# Altium schematic sheet Drone.SchDoc
size 594 x 420 mm
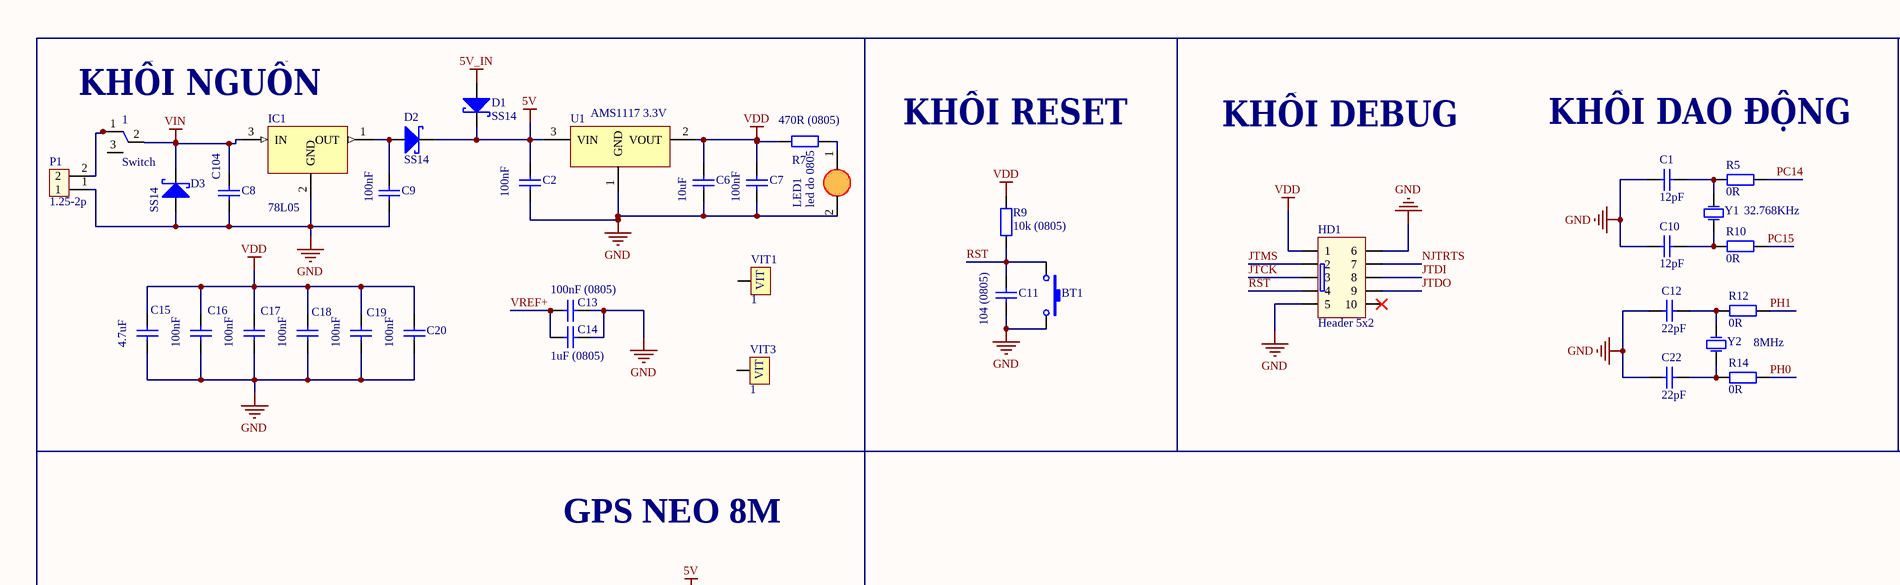
[diagram p0: Drone.SchDoc, top left]
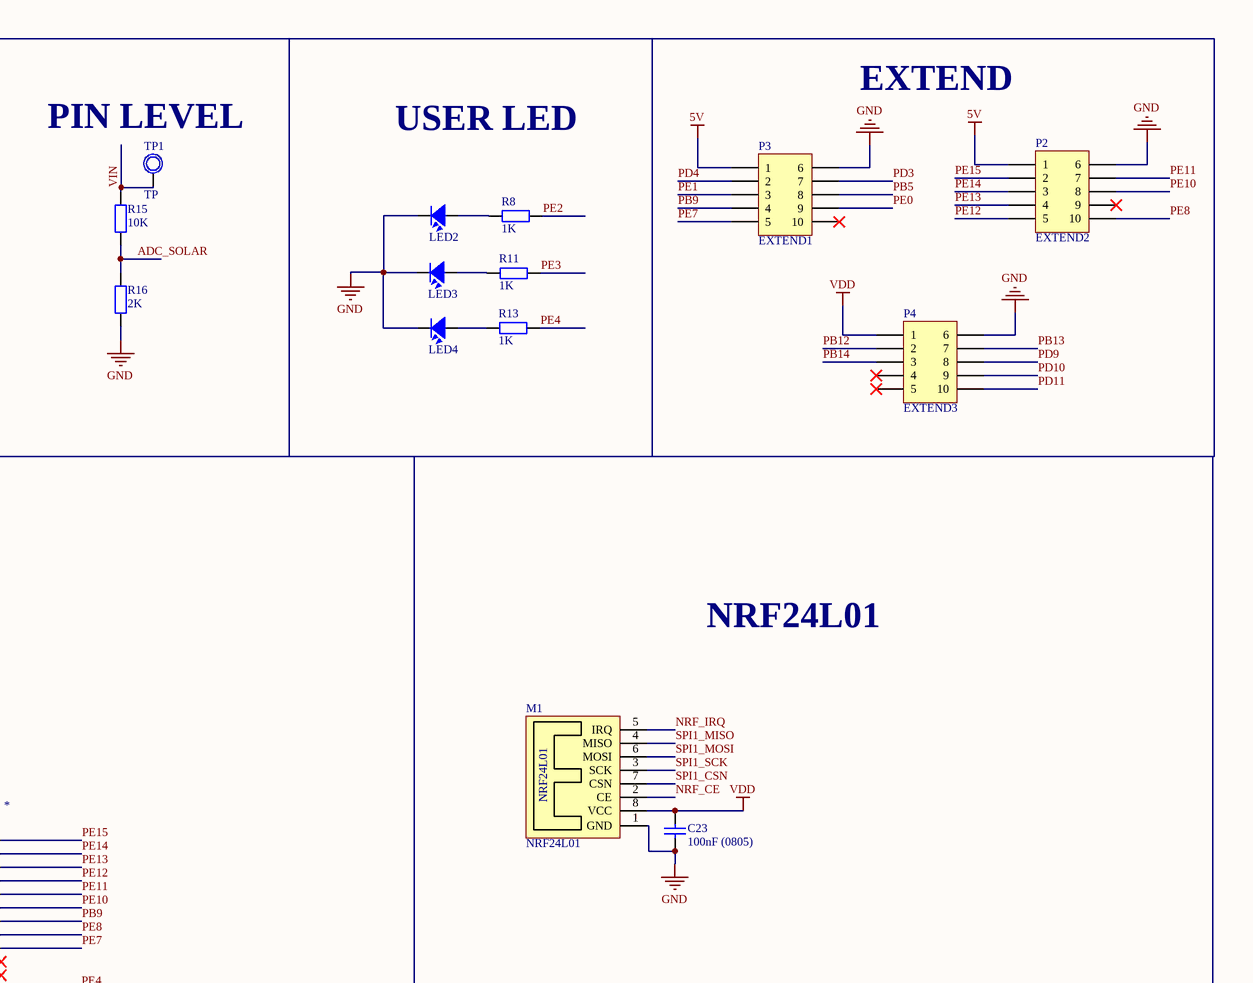
[diagram p1: Drone.SchDoc, top right]
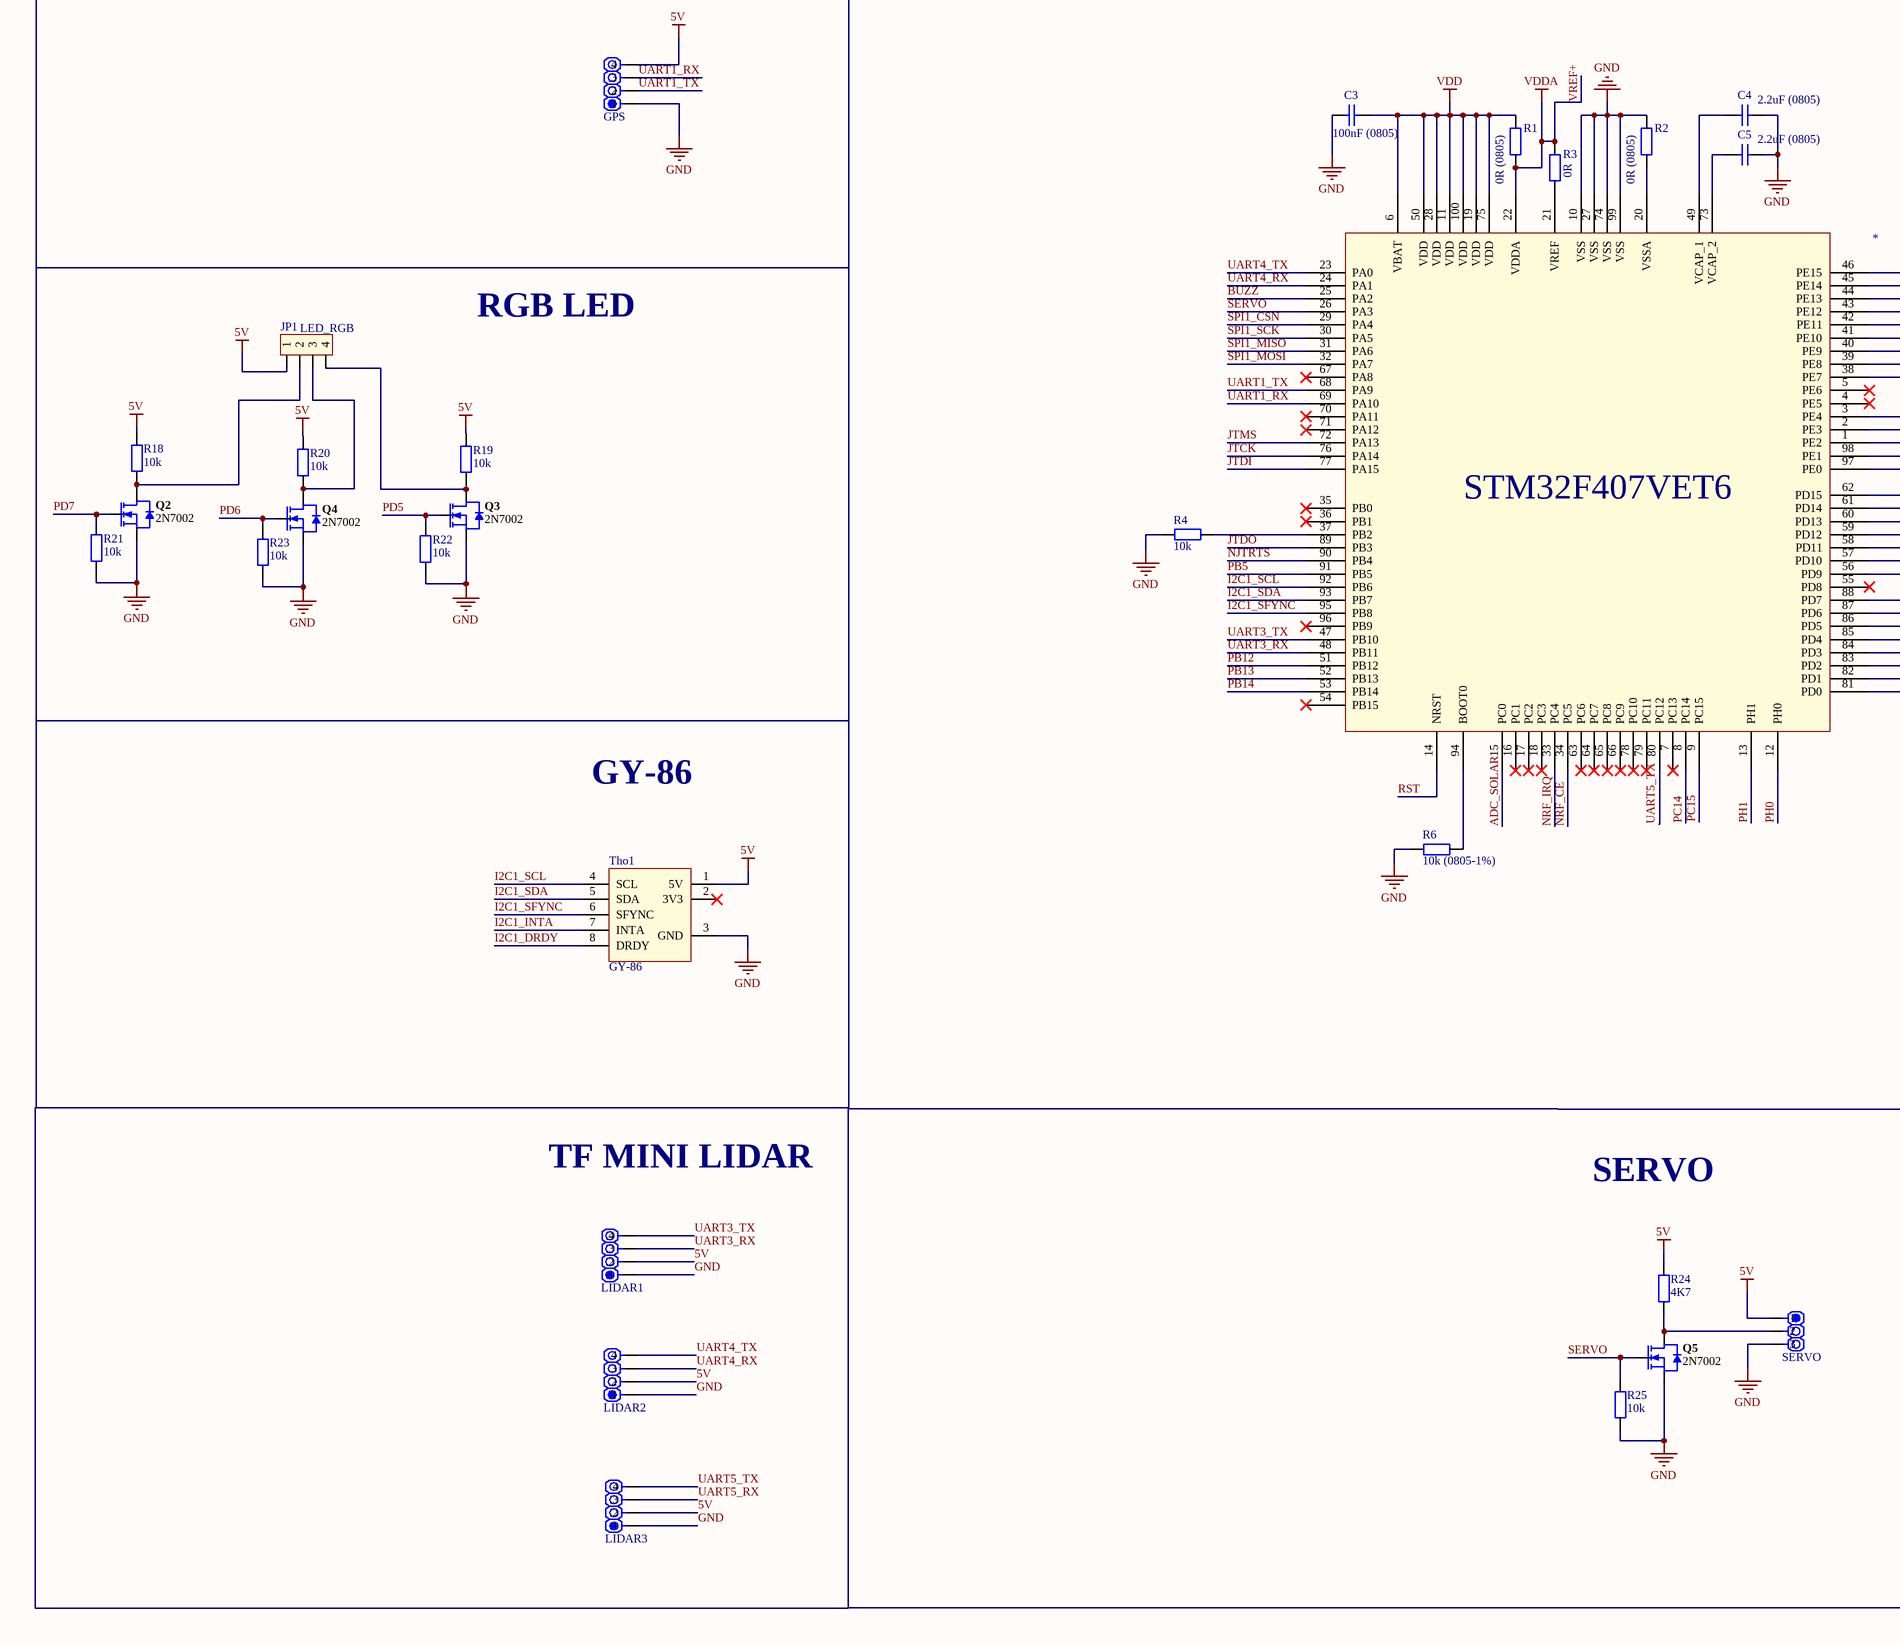
[diagram p2: Drone.SchDoc, bottom left]
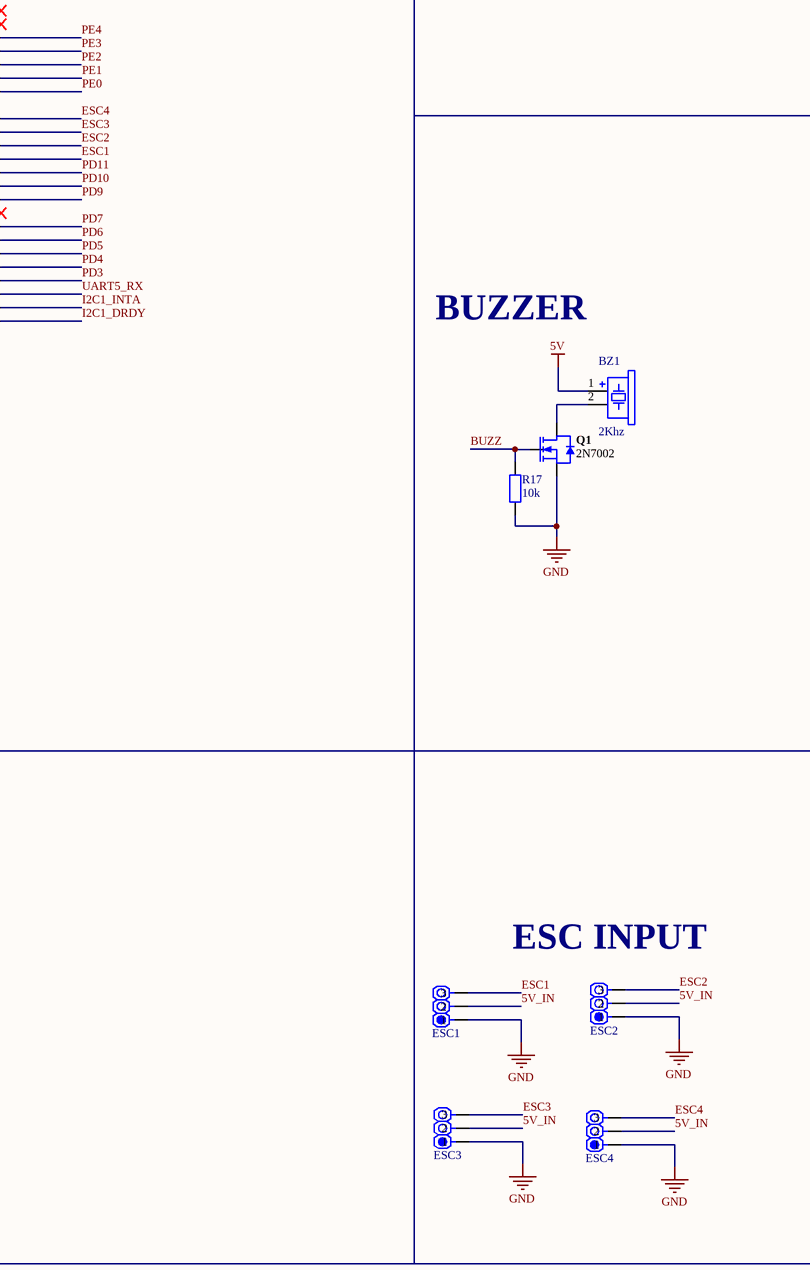
[diagram p3: Drone.SchDoc, bottom right]

## Parts
1  Switch  [SW_MSS]
*  STM32F407  [STM32F407Vet6]  (value not drawn)
BT1  Nút Nhấn 2 Chân 3x6x2.5MM SMD  [Nut Nhan 2 Chan SMD_N]  (value not drawn)
BZ1  2Khz  [coi xung]
C1  12pF  [tu 0805]
C2  100nF  [tu 0805]
C3  100nF (0805)  [tu 0805]
C4  2.2uF (0805)  [tu 0805]
C5  2.2uF (0805)  [tu 0805]
C6  10uF  [tu 0805]
C7  100nF  [tu 0805]
C8  C104  [tu 0805]
C9  100nF  [tu 0805]
C10  12pF  [tu 0805]
C11  104 (0805)  [tu 0805]
C12  22pF  [tu 0805]
C13  100nF (0805)  [tu 0805]
C14  1uF (0805)  [tu 0805]
C15  4.7uF  [tu 0805]
C16  100nF  [tu 0805]
C17  100nF  [tu 0805]
C18  100nF  [tu 0805]
C19  100nF  [tu 0805]
C20  100nF  [tu 0805]
C22  22pF  [tu 0805]
C23  100nF (0805)  [tu 0805]
D1  SS14  [DIODE SMD]
D2  SS14  [DIODE SMD]
D3  SS14  [DIODE SMD]
ESC1  IO  [CON.HDR1X3]  (value not drawn)
ESC2  IO  [CON.HDR1X3]  (value not drawn)
ESC3  IO  [CON.HDR1X3]  (value not drawn)
ESC4  IO  [CON.HDR1X3]  (value not drawn)
GPS  IO  [CON.HDR1X4L]  (value not drawn)
HD1  Header 5x2  [Hed2X5]
IC1  78L05  [SOT89-150P410X160-3N]
JP1  LED_RGB  [JUMP DON DUC 2.54_4P]
LED1  led do 0805  [led 0805]
LED2  LED SMD  [SM-LED-0805-Yellow]  (value not drawn)
LED3  LED SMD  [SM-LED-0805-Green]  (value not drawn)
LED4  LED SMD  [SM-LED-0805-Blue]  (value not drawn)
LIDAR1  IO  [CON.HDR1X4L]  (value not drawn)
LIDAR2  IO  [CON.HDR1X4L]  (value not drawn)
LIDAR3  IO  [CON.HDR1X4L]  (value not drawn)
M1  NRF24L01  [NRF24L01]
P1  1.25-2p  [Header Duc Thang 2p 1.25]
P2  EXTEND2  [HDR2X5_CEN]
P3  EXTEND1  [HDR2X5_CEN]
P4  EXTEND3  [HDR2X5_CEN]
Q1  2N7002  [SOT23-123]
Q2  2N7002  [SOT23-123]
Q3  2N7002  [SOT23-123]
Q4  2N7002  [SOT23-123]
Q5  2N7002  [SOT23-123]
R1  0R (0805)  [tro 0805]
R2  0R (0805)  [tro 0805]
R3  0R  [tro 0805]
R4  10k  [tro 0805]
R5  0R  [tro 0805]
R6  10k (0805-1%)  [tro 0805]
R7  470R (0805)  [tro 0805]
R8  1K  [tro 0805]
R9  10k (0805)  [tro 0805]
R10  0R  [tro 0805]
R11  1K  [tro 0805]
R12  0R  [tro 0805]
R13  1K  [tro 0805]
R14  0R  [tro 0805]
R15  10K  [tro 0805]
R16  2K  [tro 0805]
R17  10k  [tro 0805]
R18  10k  [tro 0805]
R19  10k  [tro 0805]
R20  10k  [tro 0805]
R21  10k  [tro 0805]
R22  10k  [tro 0805]
R23  10k  [tro 0805]
R24  4K7  [tro 0805]
R25  10k  [tro 0805]
SERVO  IO  [CON.HDR1X3]  (value not drawn)
Tho1  GY-86  [GY-86]
TP1  TP  [TP1]
U1  AMS1117 3.3V  [SOT223]
VIT1  1  [VIT]
VIT3  1  [VIT]
Y1  32.768KHz  [XT2-32.768KHz-2_V]
Y2  8MHz  [thach anh 49s smd]

## Nets
5V: BZ1.1 C2.1 D1.2(K) D2.2(K) GPS.4 JP1.1 LIDAR1.2 LIDAR2.2 LIDAR3.2 P2.1 P3.1 R18.2 R19.2 R20.2 R24.2 SERVO.1 Tho1.1(5V) U1.3(VIN)
5V_IN: D1.1(A) ESC1.2 ESC2.2 ESC3.2 ESC4.2
GND: *.10(VSS) *.27(VSS) *.74(VSS) *.99(VSS) BT1.2 C1.2 C2.2 C3.2 C4.1 C5.1 C6.2 C7.2 C8.2 C9.2 C10.2 C11.2 C12.2 C13.1 C14.1 C15.2 C16.2 C17.2 C18.2 C19.2 C20.2 C22.2 C23.2 D3.1(A) ESC1.1 ESC2.1 ESC3.1 ESC4.1 GPS.1 HD1.5 HD1.6 IC1.2(GND) LED1.2(K) LED2.2 LED3.2 LED4.2 LIDAR1.1 LIDAR2.1 LIDAR3.1 M1.1(GND) P1.1 P2.6 P3.6 P4.6 Q1.3(S) Q2.3(S) Q3.3(S) Q4.3(S) Q5.3(S) R2.2 R4.1 R6.1 R16.1 R17.1 R21.1 R22.1 R23.1 R25.1 SERVO.3 Tho1.3(GND) U1.1(GND)
VDD: *.6(VBAT) *.11(VDD) *.19(VDD) *.28(VDD) *.50(VDD) *.75(VDD) *.100(VDD) C3.1 C6.1 C7.1 C15.1 C16.1 C17.1 C18.1 C19.1 C20.1 C23.1 HD1.1 M1.8(VCC) P4.1 R1.2 R7.1 R9.2 U1.2(VOUT)
VIN: 1.2 C8.1 D3.2(K) IC1.3(IN) R15.2 TP1.1
VREF+: *.22(VDDA) C13.2 C14.2 R1.1 R3.2  [also labelled VDDA]
ADC_SOLAR: *.15(PC0) R15.1 R16.2
BUZZ: *.25(PA2) Q1.1(G) R17.2
ESC1: *.59(PD12) ESC1.3
ESC2: *.60(PD13) ESC2.3
ESC3: *.61(PD14) ESC3.3
ESC4: *.62(PD15) ESC4.3
I2C1_DRDY: *.81(PD0) Tho1.8(DRDY)
I2C1_INTA: *.82(PD1) Tho1.7(INTA)
I2C1_SCL: *.92(PB6) Tho1.4(SCL)
I2C1_SDA: *.93(PB7) Tho1.5(SDA)
I2C1_SFYNC: *.95(PB8) Tho1.6(SFYNC)
JTCK: *.76(PA14) HD1.3
JTDI: *.77(PA15) HD1.8
JTDO: *.89(PB3) HD1.9
JTMS: *.72(PA13) HD1.2
NJTRTS: *.90(PB4) HD1.7
NRF_CE: *.34(PC5) M1.2(CE)
NRF_IRQ: *.33(PC4) M1.5(IRQ)
PB5: *.91(PB5) P3.8
PB9: *.40(PE9) P3.4
PB12: *.51(PB12) P4.2
PB13: *.52(PB13) P4.7
PB14: *.53(PB14) P4.3
PC14: *.8(PC14) R5.2
PC15: *.9(PC15) R10.2
PD3: *.84(PD3) P3.7
PD4: *.85(PD4) P3.2
PD5: *.86(PD5) Q3.1(G) R22.2
PD6: *.87(PD6) Q4.1(G) R23.2
PD7: *.88(PD7) Q2.1(G) R21.2
PD9: *.56(PD9) P4.8
PD10: *.57(PD10) P4.9
PD11: *.58(PD11) P4.10
PE0: *.97(PE0) P3.9
PE1: *.98(PE1) P3.3
PE2: *.1(PE2) R8.2
PE3: *.2(PE3) R11.2
PE4: *.3(PE4) R13.2
PE7: *.38(PE7) P3.5
PE8: *.39(PE8) P2.10
PE10: *.41(PE10) P2.8
PE11: *.42(PE11) P2.7
PE12: *.43(PE12) P2.5
PE13: *.44(PE13) P2.4
PE14: *.45(PE14) P2.3
PE15: *.46(PE15) P2.2
PH0: *.12(PH0) R14.2
PH1: *.13(PH1) R12.2
RST: *.14(NRST) BT1.1 C11.1 HD1.4 R9.1
SERVO: *.26(PA3) Q5.1(G) R25.2
SPI1_CSN: *.29(PA4) M1.7(CSN)
SPI1_MISO: *.31(PA6) M1.4(MISO)
SPI1_MOSI: *.32(PA7) M1.6(MOSI)
SPI1_SCK: *.30(PA5) M1.3(SCK)
UART1_RX: *.69(PA10) GPS.3
UART1_TX: *.68(PA9) GPS.2
UART3_RX: *.48(PB11) LIDAR1.3
UART3_TX: *.47(PB10) LIDAR1.4
UART4_RX: *.24(PA1) LIDAR2.3
UART4_TX: *.23(PA0) LIDAR2.4
UART5_RX: *.83(PD2) LIDAR3.3
UART5_TX: *.80(PC12) LIDAR3.4
Net1_1: 1.1 P1.2
Net*_20: *.20(VSSA) R2.1
Net*_21: *.21(VREF) R3.1
Net*_37: *.37(PB2) R4.2
Net*_49: *.49(VCAP_1) C4.2
Net*_73: *.73(VCAP_2) C5.2
Net*_94: *.94(BOOT0) R6.2
NetBZ1_2: BZ1.2 Q1.2(D)
NetC1_1: C1.1 R5.1 Y1.1(OSC1)
NetC9_1: C9.1 D2.1(A) IC1.1(OUT)
NetC10_1: C10.1 R10.1 Y1.2(OSC2)
NetC12_1: C12.1 R12.1 Y2.1(OSC1)
NetC22_1: C22.1 R14.1 Y2.2(OSC2)
NetJP1_2: JP1.2 Q2.2(D) R18.1
NetJP1_3: JP1.3 Q4.2(D) R20.1
NetJP1_4: JP1.4 Q3.2(D) R19.1
NetLED1_1: LED1.1(A) R7.2
NetLED2_1: LED2.1 R8.1
NetLED3_1: LED3.1 R11.1
NetLED4_1: LED4.1 R13.1
NetQ5_2: Q5.2(D) R24.1 SERVO.2

Not connected (* = marked no-connect by the designer): 1 3(1); * 4(PE5)* 5(PE6)* 7(PC13)* 16(PC1)* 17(PC2)* 18(PC3)* 35(PB0)* 36(PB1)* 54(PB15)* 55(PD8)* 63(PC6)* 64(PC7)* 65(PC8)* 66(PC9)* 67(PA8)* 70(PA11)* 71(PA12)* 78(PC10)* 79(PC11)* 96(PB9)*; HD1 10*; P2 9*; P3 10*; P4 4* 5*; Tho1 2(3V3)*; VIT1 VIT1(1); VIT3 VIT1(1)

## Notes on the sheet
- KHỐI NGUỒN
- KHỐI RESET
- KHỐI DEBUG
- KHỐI DAO ĐỘNG
- (near TP1) PIN LEVEL
- EXTEND
- USER LED
- GPS NEO 8M
- NRF24L01
- RGB LED
- BUZZER
- GY-86
- TF MINI LIDAR
- SERVO
- (near ESC2) ESC INPUT
- (in symbol STM32F407) STM32F407VET6

## Library data of the parts
BT1 = Nut Nhan 2 Chan SMD: Dán; Don_Vi: Con; So_Chan: 2; Ma_Hang: MH001036; Kieu_Chan: *; Ten_Linh_Kien: Nút Nhấn 2 Chân 3x6x2.5MM SMD; Chung_Loai: Dán
BZ1 = Coi xung 2Khz: Cắm; Don_Vi: Con; Ma_Hang: MH007704; Ten_Linh_Kien: Còi Xung 8.5x12MM 16R 2Khz 3-12V; Chung_Loai: Cắm
C1 C10 C12 C22 = Tu 0805 10pF 50V 10%: Dán; Don_Vi: Con; So_Chan: 2; Ten_Linh_Kien: Tụ 0805 10P 10% 50V; Ma_Hang: MH004554; Chung_Loai: Dán; Kieu_Chan: *
C2 C6-C9 C11 C15-C20 = Tu 0805 104 50V 10%: Dán; Don_Vi: Con; So_Chan: 2; Ten_Linh_Kien: Tụ 0805 104-100nF 10% 50V; Ma_Hang: MH004551; Chung_Loai: Dán; Kieu_Chan: *
C3-C5 C13 C14 C23 = Tu 0805 220nF 50V 10%: Dán; Don_Vi: Con; So_Chan: 2; Ten_Linh_Kien: Tụ 0805 220nF 50V 10%; Ma_Hang: MH008099; Chung_Loai: Dán; Kieu_Chan: *
D1-D3 = Diode SS14 ( 1N5819): Dán; Ma_Hang: MH002211; Don_Vi: Con; So_Chan: 2; Kieu_Chan: DO214; Ten_Linh_Kien: Diode SS14 DO214 Schottky 1A 40V ( 1N5819 DO214); Chung_Loai: Dán
ESC1-ESC4 SERVO = CON.HDR1x3: Header 1x3; Publisher: NKIM; ComponentLink1Description: Digikey Part link; ComponentLink2Description: Open DataSheet; ComponentLink2URL: H:\LIBRARY\LIBRARY.Datasheet\
GPS LIDAR1-LIDAR3 = CON.HDR1x4: Header 1x4; Publisher: NKIM; ComponentLink1Description: Digikey Part link; ComponentLink2Description: Open DataSheet; ComponentLink2URL: H:\LIBRARY\LIBRARY.Datasheet\
HD1 = HED5x2: Value: Header 5x2
IC1 = 78L05: Dán; Ten_Linh_Kien: 78L05 SOT89 0.1A 5V; So_Chan: 3; Kieu_Chan: SOT89; Chung_Loai: Dán
JP1 = Jump Don Duc 2.54_4P: Cắm; Ten_Linh_Kien: Jump Đơn Đực 2.54MM 2x40P Thẳng 11MM; Don_Vi: Con; So_Chan: 4; Kieu_Chan: *; Ma_Hang: *; Chung_Loai: Cắm
LED1 = Led 0805 Do: Dán; Don_Vi: Con; So_Chan: 2; Ten_Linh_Kien: LED 0805 Màu Đỏ; Ma_Hang: MH000897; Chung_Loai: Dán; Kieu_Chan: *
LED2-LED4 = LED-SMD-0805
P1 = Header 1.25-2p: Cắm; Don_Vi: Con; Ten_Linh_Kien: Header 2p 1.25MM Đực Thẳng 1.25-2A; Ma_Hang: MH008254; Chung_Loai: Cắm
P2-P4 = Header 5X2A: Header, 5-Pin, Dual row; LatestRevisionDate: 17-Jul-2002; LatestRevisionNote: Re-released for DXP Platform.; Publisher: Altium Limited
Q1-Q5 = 2N7002: N-channel Enhancement Mode Field-effect Transistor; Transistor Type: NPN; Mounting Technology: Surface Mount; Status: Unreleased; Category: Transistor-FET
R1-R3 R5 R7 R8 R10-R14 = Tro 0805 5% 470R: Dán; Don_Vi: Con; Ma_Hang: MH005341; Ten_Linh_Kien: Trở 0805 5% 470R; So_Chan: 2; Chung_Loai: Dán; Kieu_Chan: *
R4 R6 R17-R25 = Tro 0805 1% 10k: Dán; Don_Vi: Con; So_Chan: 2; Ten_Linh_Kien: Trở 0805 1% 10k; Ma_Hang: MH005473; Chung_Loai: Dán; Kieu_Chan: *
R9 R15 R16 = Tro 0805 5% 10k: Dán; Don_Vi: Con; So_Chan: 2; Ten_Linh_Kien: Trở 0805 5% 10k; Ma_Hang: MH005239; Chung_Loai: Dán; Kieu_Chan: *
TP1 = TP1: Test Point; Value: Test Point
U1 = AMS1117 3.3V: Dán; Ten_Linh_Kien: AMS1117-3.3V SOT223; Don_Vi: Con; So_Chan: 4; Ma_Hang: MH000596; Kieu_Chan: SOT223; Chung_Loai: Dán
VIT1 VIT3 = VIT: Oc Vit
Y1 Y2 = Thach anh 8MHz 49S SMD: Dán; Kieu_Chan: 49S SMD; Don_Vi: Con; So_Chan: 2; Ten_Linh_Kien: Thạch anh 8MHz 49S SMD; Ma_Hang: MH001985; Chung_Loai: Dán